# EAGLE design bucket-banging (EAGLE 8.3.2)
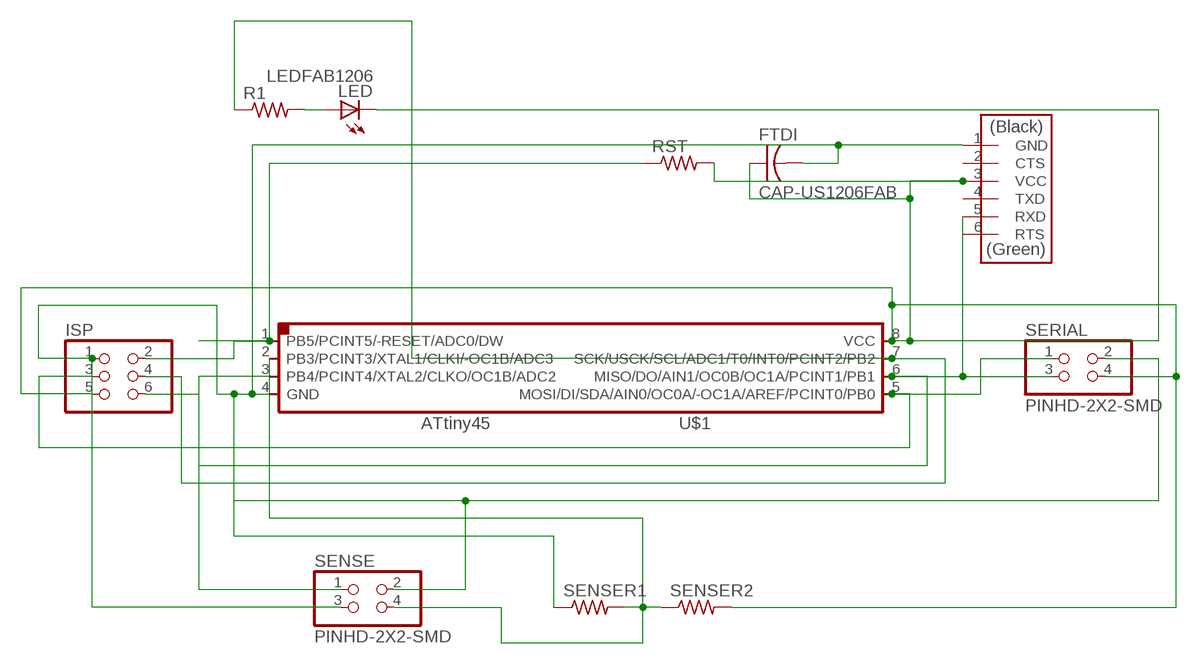
[diagram p0: schematic, sheet 1]

## Parts
FTDI  CAP-US1206FAB  [C1206FAB]
ISP  PINHD-2X3-SMD  [2X03SMD]
LED  LEDFAB1206  [LED1206FAB]
R1  RES-US1206FAB  [R1206FAB]
RST  RES-US1206FAB  [R1206FAB]
SENSE  PINHD-2X2-SMD  [2X02SMD]
SENSER1  RES-US1206FAB  [R1206FAB]
SENSER2  RES-US1206FAB  [R1206FAB]
SERIAL  PINHD-2X2-SMD  [2X02SMD]
U$1  ATTINY45SI  [SOIC8]
U$2  FTDI-SMD-HEADER  [1X06SMD]

## Nets
N$1: FTDI.2 ISP.1 SENSE.2 SENSE.3 SENSER1.1 SERIAL.2 U$1.4(GND) U$2.1(GND)
N$2: ISP.3 SERIAL.1 U$1.5(MOSI/DI/SDA/AIN0/OC0A/-OC1A/AREF/PCINT0/PB0)
N$3: ISP.6 SERIAL.3 U$1.6(MISO/DO/AIN1/OC0B/OC1A/PCINT1/PB1) U$2.5(RXD)
N$4: ISP.4 R1.1 U$1.7(SCK/USCK/SCL/ADC1/T0/INT0/PCINT2/PB2)
N$5: ISP.2 RST.1 U$1.1(PB5/PCINT5/-RESET/ADC0/DW)
N$6: LED.1(A) R1.2
N$7: SENSE.4 SENSER1.2 SENSER2.1 U$1.2(PB3/PCINT3/XTAL1/CLKI/-OC1B/ADC3)
N$10: FTDI.1 ISP.5 LED.2(C) RST.2 SENSER2.2 SERIAL.4 U$1.8(VCC) U$2.3(VCC)
N$11: SENSE.1 U$1.3(PB4/PCINT4/XTAL2/CLKO/OC1B/ADC2)
Unconnected: U$2.2(CTS) U$2.4(TXD) U$2.6(RTS)

## Library data of the parts
FTDI = fab:CAP-US
ISP = fab:PINHD-2X3-SMD: PIN HEADER
LED = fab:LED: LED
R1 RST SENSER1 SENSER2 = fab:RES-US: Resistor (US Symbol) Variants with postfix FAB are widened to allow the routing of internal traces
SENSE SERIAL = fab:PINHD-2X2-SMD
U$1 = fab:ATTINY45
U$2 = fab:FTDI-SMD-HEADER

## Board
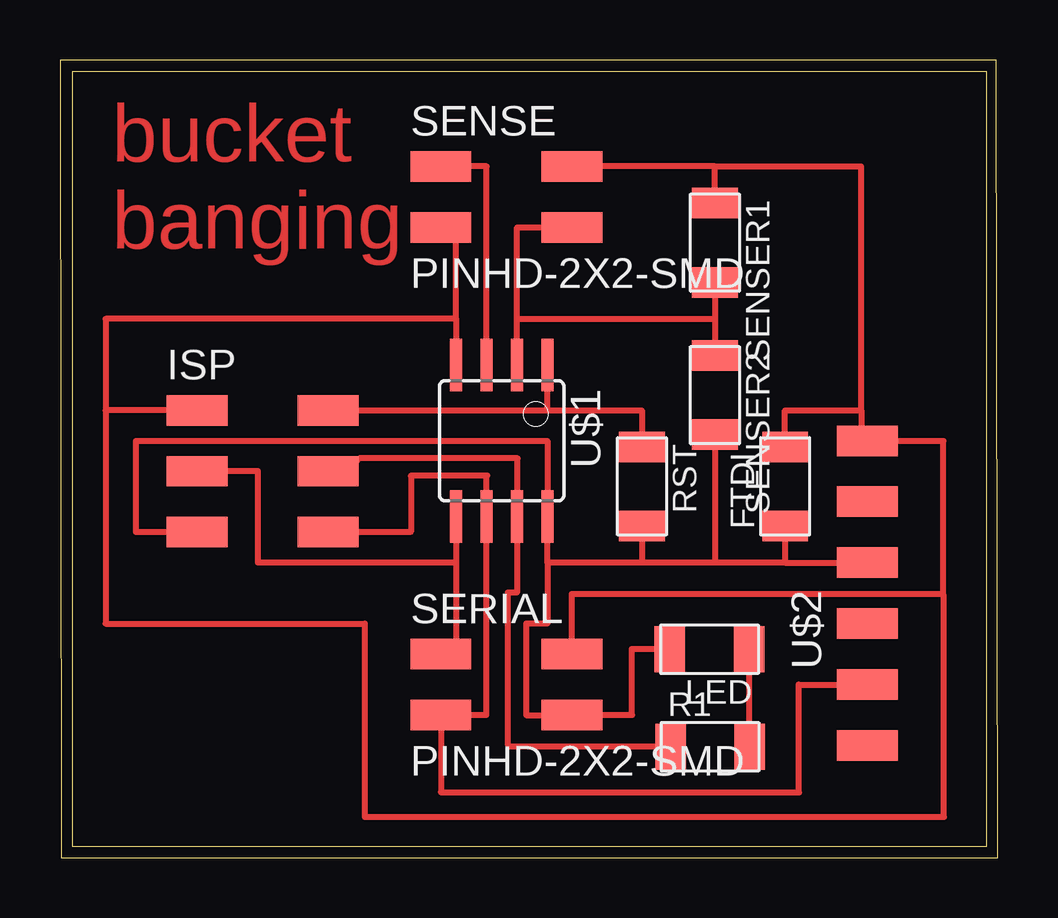
[diagram p1: board, top side]
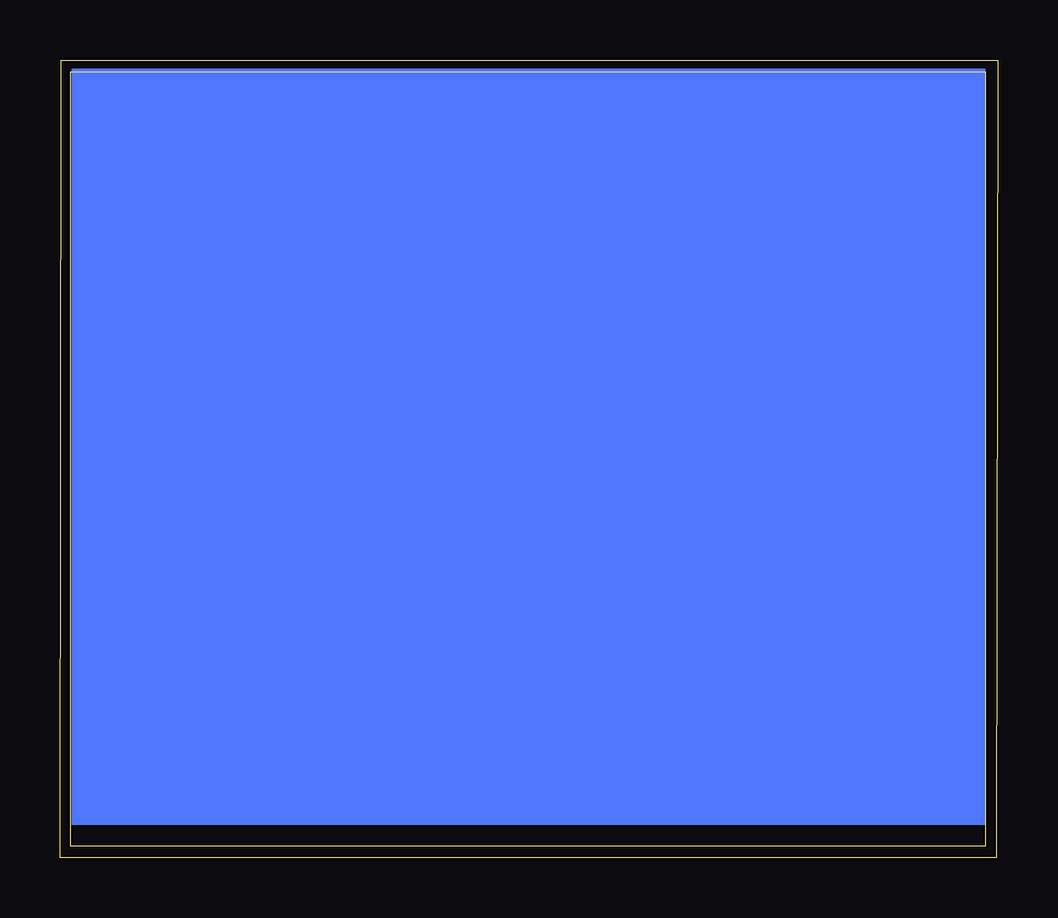
[diagram p2: board, bottom side, seen from below]

Size 39.09 x 33.24 mm. Coordinates in mm from the lower left corner, seen from the top.
Outline: 0.05,0 39.09,0 39.04,33.24 0,33.24 0.05,0
Copper layers (1*16): Top 0.035mm / dielectric 1.5mm / Bottom 0.035mm
Design rules "default": minimum track width 6mil, minimum drill 0.35mm, track to track 6mil, track to pad 6mil, pad to pad 6mil, via to via 6mil, smd to smd 6mil, copper to edge 40mil, drill to drill 6mil, minimum pad ring 10mil, minimum via ring 8mil, stop-mask expansion 4mil, vias tented up to drill 0mil, thermal gap 10mil

### Footprints (pad centres in the part's own frame; a part is rotated, then mirrored left to right if it is on the bottom)
C1206FAB = smd 1.27 x 1.905: 1 -1.651,0; 2 1.651,0
2X03SMD = smd 2.54 x 1.27: 1 -2.54,2.54; 2 2.92,2.54; 3 -2.54,0; 4 2.92,0; 5 -2.54,-2.54; 6 2.92,-2.54
LED1206FAB = smd 1.27 x 1.905: 1 -1.651,0; 2 1.651,0
R1206FAB = smd 1.27 x 1.905: 1 -1.651,0; 2 1.651,0
2X02SMD = smd 2.54 x 1.27: 1 -2.54,1.27; 2 2.92,1.27; 3 -2.54,-1.27; 4 2.92,-1.27
SOIC8 = smd 0.5 x 2.2: 1 -1.905,-3.154; 2 -0.645,-3.154; 3 0.625,-3.154; 4 1.895,-3.154; 5 1.905,3.154; 6 0.635,3.154; 7 -0.635,3.154; 8 -1.905,3.154
1X06SMD = smd 2.54 x 1.27: 1 0,6.35; 2 0,3.81; 3 0,1.27; 4 0,-1.27; 5 0,-3.81; 6 0,-6.35

### Placement (x,y rotation side)
FTDI  30.23,15.47 90 top
ISP  8.26,16.1 0 top
LED  27.08,8.69 180 top
R1  27.1,4.62 0 top
RST  24.26,15.47 270 top
SENSE  18.41,27.53 0 top
SENSER1  27.3,25.63 270 top
SENSER2  27.3,19.28 270 top
SERIAL  18.41,7.21 0 top
U$1  18.41,17.37 180 top
U$2  33.66,11.02 0 top

### Tracks (layer width: path | path; a pad name or v marks a point on that pad's centre or on a via)
N$1
  Top 0.254: ISP.1 1.91,18.64 | 21.59,28.8 SENSE.2 | 16.52,22.45 U$1.4 | 16.52,22.45 16.52,26.26 SENSE.3 | SENSER1.1 27.3,28.8 | 27.3,28.8 SENSE.2 | 20.95,28.8 SENSE.2 | 29.84,17.37 FTDI.2 30.23,18.64 33.4,18.64 | 16.52,22.45 1.91,22.45 1.91,18.64 | 27.3,28.8 33.4,28.8 33.4,18.64 | 33.4,18.64 33.4,17.37 U$2.1 36.83,17.37 36.83,10.95 | 1.91,18.64 1.91,9.75 12.7,9.75 12.7,1.7 36.85,1.7 36.83,1.73 36.83,10.95 | SERIAL.2 21.34,11 36.78,11 36.83,10.95
N$2
  Top 0.254: U$1.5 16.51,12.29 | 16.51,12.29 16.51,8.48 SERIAL.1 | 16.51,12.29 8.26,12.29 8.26,16.1 ISP.3
N$3
  Top 0.254: ISP.6 14.61,13.56 14.63,13.59 14.63,15.9 14.66,15.93 17.8,15.93 17.78,15.9 U$1.6 17.78,5.94 SERIAL.3 15.88,2.74 15.9,2.72 30.81,2.72 30.81,7.19 30.79,7.21 U$2.5
N$4
  Top 0.254: ISP.4 12.32,16.1 12.32,16.48 12.47,16.64 19.07,16.64 19.05,16.61 U$1.7 19.05,11.05 18.67,11.05 18.67,4.75 18.69,4.62 R1.1
N$5
  Top 0.254: ISP.2 20.32,18.64 | 20.32,18.64 U$1.1 | 20.32,18.64 24.26,18.64 RST.1 | U$1.1 20.32,20.55 U$1.1
N$6
  Top 0.254: LED.1 28.73,4.65 R1.2
N$7
  Top 0.254: 21.34,26.01 SENSE.4 19.06,26.26 19.06,22.45 | U$1.2 19.06,22.45 | SENSER1.2 27.3,22.45 | 27.3,22.45 SENSER2.1 | 19.06,22.45 27.3,22.45
N$10
  Top 0.254: 30.23,12.29 27.3,12.29 | 30.23,12.29 U$2.3 | ISP.5 3.17,13.56 3.17,17.37 20.32,17.37 U$1.8 20.32,12.29 | 27.3,12.29 24.26,12.29 | SENSER2.2 27.3,12.29 | 20.32,12.29 20.32,9.75 19.43,9.75 19.43,5.94 SERIAL.4 23.85,5.94 23.82,5.97 23.82,8.69 LED.2 | RST.2 24.26,12.29 | FTDI.1 30.23,12.29 | 24.26,12.29 20.32,12.29
N$11
  Top 0.254: U$1.3 17.79,28.8 SENSE.1
(copper drawn outside any net)
  shapes: Bottom area x1

### Text on the board
Top: bucket / banging